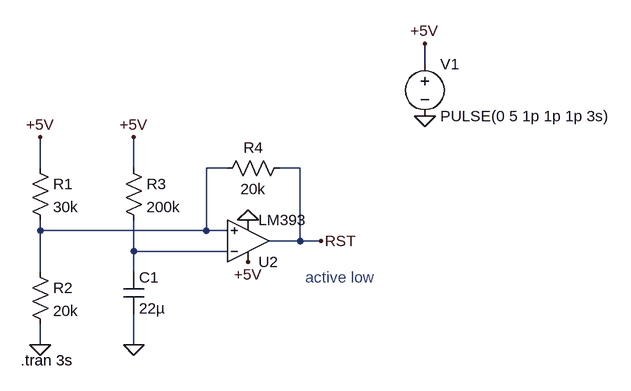
[diagram p0: schematic new_autoreset.asc]
new_autoreset.asc, the LTspice schematic file:
Version 4
SHEET 1 920 680
WIRE 576 -112 576 -144
WIRE -16 48 -16 0
WIRE 128 48 128 0
WIRE 272 48 240 48
WIRE 384 48 352 48
WIRE -16 144 -16 128
WIRE 240 144 240 48
WIRE 240 144 -16 144
WIRE 272 144 240 144
WIRE 384 160 384 48
WIRE 384 160 336 160
WIRE 416 160 384 160
WIRE 128 176 128 128
WIRE 272 176 128 176
WIRE -16 208 -16 144
WIRE 128 208 128 176
WIRE -16 320 -16 288
WIRE 128 320 128 272
FLAG 416 160 RST
FLAG 576 -32 0
FLAG 576 -144 +5V
FLAG -16 320 0
FLAG 128 320 0
FLAG -16 0 +5V
FLAG 128 0 +5V
FLAG 304 128 0
FLAG 304 192 +5V
SYMBOL res -32 32 R0
SYMATTR InstName R1
SYMATTR Value 30k
SYMBOL res -32 192 R0
SYMATTR InstName R2
SYMATTR Value 20k
SYMBOL voltage 576 -128 R0
WINDOW 123 0 0 Left 0
WINDOW 39 0 0 Left 0
SYMATTR InstName V1
SYMATTR Value PULSE(0 5 1p 1p 1p 3s)
SYMBOL cap 112 208 R0
SYMATTR InstName C1
SYMATTR Value 22µ
SYMBOL res 112 32 R0
SYMATTR InstName R3
SYMATTR Value 200k
SYMBOL res 368 32 R90
WINDOW 0 0 56 VBottom 2
WINDOW 3 32 56 VTop 2
SYMATTR InstName R4
SYMATTR Value 20k
SYMBOL ZZZ\\Comparator\\lm393 304 160 M180
SYMATTR InstName U2
TEXT -46 344 Left 2 !.tran 3s
TEXT 392 216 Left 2 ;active low

The netlist it stands for:
* new_autoreset.asc
R1 +5V N001 30k
R2 N001 0 20k
V1 +5V 0 PULSE(0 5 1p 1p 1p 3s)
C1 N002 0 22µ
R3 +5V N002 200k
R4 RST N001 20k
XU2 N001 N002 +5V 0 RST LM393  ; pins In+ In- V+ V- OUT
.tran 3s
* active low
.backanno
.end